# Altium project DustCollectorSwitch.PrjPcb
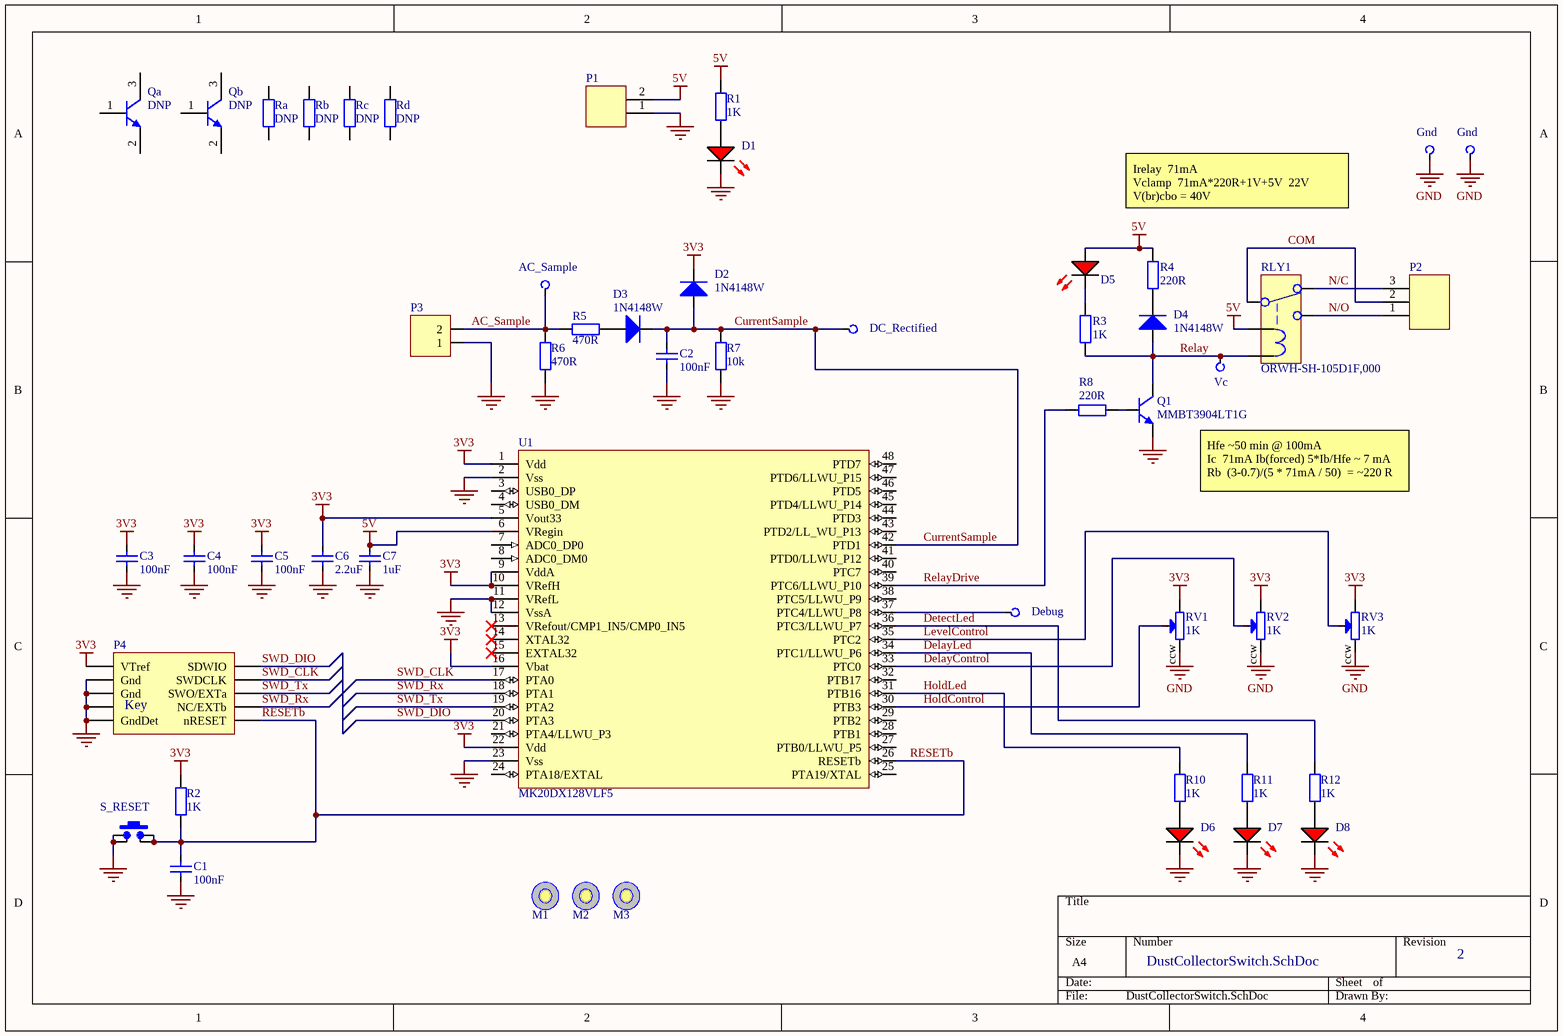
[diagram p0: DustCollectorSwitch.SchDoc]
Version: 2
1 sheet, 52 parts. Net scope: global (net labels, ports and power ports of the same name join across sheets).
Board file: DustCollectorSwitch.PcbDoc

## Sheet DustCollectorSwitch.SchDoc
size A4

### Parts
AC_Sample  (no value)  [PCBPIN - 0.9mm]  (no BOM)
C1  100nF  [CCNP1608-0603_N]
C2  100nF  [CCNP1608-0603_N]
C3  100nF  [CCNP1608-0603_N]
C4  100nF  [CCNP1608-0603_N]
C5  100nF  [CCNP1608-0603_N]
C6  2.2uF  [CCNP1608-0603_N]
C7  1uF  [CCNP1608-0603_N]
D1  LED Red  [LED1608-0603-RED]  (value not drawn)
D2  1N4148W  [SOD-123]
D3  1N4148W  [SOD-123]
D4  1N4148W  [SOD-123]
D5  LED Red  [LED1608-0603-RED]  (value not drawn)
D6  LED Red  [LED1608-0603-RED]  (value not drawn)
D7  LED Red  [LED1608-0603-RED]  (value not drawn)
D8  LED Red  [LED1608-0603-RED]  (value not drawn)
DC_Rectified  (no value)  [PCBPIN - 0.9mm]  (no BOM)
Debug  Vdd  [PCBPIN - 0.9mm]  (value not drawn)  (no BOM)
Gnd1  Gnd  [PCBPIN - 0.9mm]  (no BOM)
Gnd?  Gnd  [PCBPIN - 0.9mm]  (no BOM)
M1  Mounting hole  [3mm hole]  (value not drawn)  (no BOM)
M2  Mounting hole  [3mm hole]  (value not drawn)  (no BOM)
M3  Mounting hole  [3mm hole]  (value not drawn)  (no BOM)
P1  Terminal2_5.08mm  [MOLEX-39544-3002]  (value not drawn)
P2  Terminal3_5.08mm  [MOLEX-39544-3003]  (value not drawn)
P3  Header, 2-Pin, Right Angle  [HDR1X2H]  (value not drawn)
P4  SWD Connector 2x5-Pin  [SWD-2x5-Jig-Pads]  (value not drawn)  (no BOM)
Q1  MMBT3904LT1G  [SOT23_N]
Qa  DNP  [SOT23_M]  (no BOM)
Qb  DNP  [SOT23_M]  (no BOM)
R1  1K  [CR1608-0603_N]
R2  1K  [CR1608-0603_N]
R3  1K  [CR1608-0603_N]
R4  220R  [CR1608-0603_N]
R5  470R  [CR1608-0603_N]
R6  470R  [CR1608-0603_N]
R7  10k  [CR1608-0603_N]
R8  220R  [CR1608-0603_N]
R10  1K  [CR1608-0603_N]
R11  1K  [CR1608-0603_N]
R12  1K  [CR1608-0603_N]
Ra  DNP  [CR1608-0603_N]  (no BOM)
Rb  DNP  [CR1608-0603_N]  (no BOM)
Rc  DNP  [CR1608-0603_N]  (no BOM)
Rd  DNP  [CR1608-0603_N]  (no BOM)
RLY1  ORWH-SH-105D1F,000  [Relay - ORWH-SH]
RV1  1K  [RV_PCB5]
RV2  1K  [RV_PCB5]
RV3  1K  [RV_PCB5]
S_RESET  SMD-SW-4_5.1x5.1x3.5_M  [SMD-SW-4_5.1x5.1x3.5_M]  (value not drawn)
U1  MK20DX128VLF5  [TSQFP50P900X900-48M]
Vc  (no value)  [PCBPIN - 0.9mm]  (no BOM)

### Nets
3V3: C3.1 C4.2 C5.2 C6.2 D2.K P4.1(VTref) R2.1 RV1.cw RV2.cw RV3.cw U1.1(Vdd) U1.5(Vout33) U1.9(VddA) U1.10(VRefH) U1.16(Vbat) U1.22(Vdd)
5V: C7.2 D5.A P1.2 R1.1 R4.1 RLY1.C1 U1.6(VRegin)
GND: C1.2 C2.1 C3.2 C4.1 C5.1 C6.1 C7.1 D1.K D6.K D7.K D8.K Gnd1.1(TP) Gnd?.1(TP) P1.1 P3.1 P4.0(Pins) P4.3(Gnd) P4.5(Gnd) P4.9(GndDet) Q1.2(E) R6.1 R7.1 RV1.ccw RV2.ccw RV3.ccw S_RESET.1 S_RESET.1b U1.2(Vss) U1.11(VRefL) U1.12(VssA) U1.23(Vss)
AC_Sample: AC_Sample.1(TP) P3.2 R5.2 R6.2
COM: P2.2 RLY1.COM
CurrentSample: C2.2 D2.A D3.K DC_Rectified.1(TP) R7.2 U1.42(PTD1)
DelayControl: RV2.w U1.33(PTC0)
DelayLed: R11.1 U1.34(PTC1/LLWU_P6)
DetectLed: R12.1 U1.36(PTC3/LLWU_P7)
HoldControl: RV1.w U1.30(PTB3)
HoldLed: R10.1 U1.31(PTB16)
LevelControl: RV3.w U1.35(PTC2)
N/C: P2.3 RLY1.NC
N/O: P2.1 RLY1.NO
Relay: D4.A Q1.3(C) R3.2 RLY1.C2 Vc.1(TP)
RelayDrive: R8.1 U1.39(PTC6/LLWU_P10)
RESETb: C1.1 P4.10(nRESET) R2.2 S_RESET.2 S_RESET.2b U1.26(RESETb)
SWD_CLK: P4.4(SWDCLK) U1.17(PTA0)
SWD_DIO: P4.2(SDWIO) U1.20(PTA3)
SWD_Rx: P4.8(NC/EXTb) U1.18(PTA1)
SWD_Tx: P4.6(SWO/EXTa) U1.19(PTA2)
NetD1_A: D1.A R1.2
NetD3_A: D3.A R5.1
NetD4_K: D4.K R4.2
NetD5_K: D5.K R3.1
NetD6_A: D6.A R10.2
NetD7_A: D7.A R11.2
NetD8_A: D8.A R12.2
NetDebug_1: Debug.1(TP) U1.37(PTC4/LLWU_P8)
NetQ1_1: Q1.1(B) R8.2

Not connected (* = marked no-connect by the designer): Qa 1(B) 2(E) 3(C); Qb 1(B) 2(E) 3(C); Ra 1 2; Rb 1 2; Rc 1 2; Rd 1 2; U1 3(USB0_DP) 4(USB0_DM) 7(ADC0_DP0) 8(ADC0_DM0) 13(VRefout/CMP1_IN5/CMP0_IN5)* 14(XTAL32)* 15(EXTAL32)* 21(PTA4/LLWU_P3) 24(PTA18/EXTAL) 25(PTA19/XTAL) 27(PTB0/LLWU_P5) 28(PTB1) 29(PTB2) 32(PTB17) 38(PTC5/LLWU_P9) 40(PTC7) 41(PTD0/LLWU_P12) 43(PTD2/LL_WU_P13) 44(PTD3) 45(PTD4/LLWU_P14) 46(PTD5) 47(PTD6/LLWU_P15) 48(PTD7)

### Notes on the sheet
- Irelay  71mA
  Vclamp  71mA*220R+1V+5V  22V
  V(br)cbo = 40V
- Hfe ~50 min @ 100mA
  Ic  71mA Ib(forced) 5*Ib/Hfe ~ 7 mA
  Rb  (3-0.7)/(5 * 71mA / 50)  = ~220 R
- (in symbol SWD2X5_JIG) Key

### Library data of the parts
AC_Sample DC_Rectified Debug Gnd1 Gnd? Vc = TP: Test Point; Digikey: *; Farnell PN: *; LCSC: *
C1-C5 = Cap_CCNP_0603_100nF: Capacitor non-polar SMT 0603; Manufacturer: Generic Components; Class: Passive; Published: 08/06/2000; Publisher: Altium Hobart Technology Centre; SubClass: Capacitor; Farnell PN: *; Digikey: *; Value: 100nF; LCSC: C14663
C6 C7 = Cap: Capacitor; Manufacturer: Generic Components; Class: Passive; Published: 08/06/2000; Publisher: Altium Hobart Technology Centre; SubClass: Capacitor; Farnell PN: *; Digikey: *
  C6: Value: 2.2uF; LCSC: C23630
  C7: Value: 1uF; LCSC: C15849
D1 D5-D8 = LED-0603-Red: LED 0603 Red; Manufacturer: Generic Components; Class I: Optoelectronic; Published: 8-Jun-2000; Revision: July-2002: Re-released for DXP Platform.; Publisher: Altium Limited; Class II: LED; Farnell PN: 1581239; Digikey: *; LCSC: C2286
D2-D4 = 1N4148W: Diode - Switching 75V 150mA 1.25V @ 150mA 4ns, SOD-123; Class: Discrete; SubClass: Diode - Switching; Digikey: *; Farnell PN: *; LCSC: C81598
M1-M3 = Mounting_Hole: LCSC: *
P1 = Terminal2_5.08mm: MULTICOMP MC24366 TERMINAL BLOCK EUROSTYLE, 2 POSITION, 26-12AWG, 5.08mm; Farnell PN: 2396251; LCSC: *
P2 = Terminal3_5.08mm: MULTICOMP MC24367 TERMINAL BLOCK EUROSTYLE, 3 POSITION, 26-12AWG, 5.08mm; Farnell PN: *; LCSC: *
P3 = Header 1x2H: LatestRevisionDate: 17-Jul-2002; LatestRevisionNote: Re-released for DXP Platform.; Publisher: Altium Limited; LCSC: *
P4 = SWD2X5_JIG: LatestRevisionDate: 17-Jul-2002; LatestRevisionNote: Re-released for DXP Platform.; Publisher: Altium Limited; Farnell PN: 1865285; LCSC: *
Q1 = MMBT3904LT1G: General Purpose Transistor, NPN Silicon, 3-Pin SOT-23, Pb-Free, Tape and Reel; Manufacturer: On Semiconductor; IC Continuous (A): 0.2; fT Min (MHz): 300; ComponentLink2Description: Datasheet; Polarity: NPN; PackageDescription: 3-Pin Small Outline Transistor, Body 2.92 x 1.3 mm, Pitch 0.95 mm; ComponentLink2URL: http://www.onsemi.cn/pub_link/Collateral/MMBT3904LT1-D.PDF; DatasheetVersion: Rev. 12; Mounting Technology: Surface Mount; PartNumber: MMBT3904LT1G; ComponentLink1URL: http://www.onsemi.com/; ComponentLink3Description: Package Specification; ComponentLink1Description: Manufacturer URL; PackageVersion: Rev. AP, 11/2009; PackageReference: SOT-23-3-318-08; Packing: Tape and Reel; ComponentLink3URL: http://www.onsemi.cn/pub_link/Collateral/318-08.PDF; RoHS: TRUE; LCSC: C20526
Qa Qb = MMBT3904LT1G: SOT23; ComponentLink2Description: Datasheet; ComponentLink2URL: http://www.onsemi.cn/pub_link/Collateral/MMBT3904LT1-D.PDF; ComponentLink1URL: http://www.onsemi.com/; ComponentLink3Description: Package Specification; ComponentLink1Description: Manufacturer URL; ComponentLink3URL: http://www.onsemi.cn/pub_link/Collateral/318-08.PDF
R1-R3 R10-R12 Ra Rb Rc Rd = Res_CR0603: Resistor SMT 0603; Manufacturer: Generic Components; Class: Passive; Published: 08/06/2000; Publisher: Altium Hobart Technology Centre; SubClass: Resistor; Farnell PN: *; Digikey: *
  R1-R3 R10-R12: Value: 1K; LCSC: C21190
  Ra Rb Rc Rd: Value: DNP
R4 R8 = Res_CR0603_220R: Resistor SMT 0603; Manufacturer: Generic Components; Class: Passive; Published: 08/06/2000; Publisher: Altium Hobart Technology Centre; SubClass: Resistor; Farnell PN: *; Digikey: *; LCSC: C22962; Value: 220R
R5 R6 = Res_CR0603_470R: Resistor SMT 0603; Manufacturer: Generic Components; Class: Passive; Published: 08/06/2000; Publisher: Altium Hobart Technology Centre; SubClass: Resistor; Farnell PN: *; Digikey: *; LCSC: C23179; Value: 470R
R7 = Res_CR0603_10k: Resistor SMT 0603; Manufacturer: Generic Components; Class: Passive; Published: 08/06/2000; Publisher: Altium Hobart Technology Centre; SubClass: Resistor; Farnell PN: *; Digikey: *; LCSC: C25804; Value: 10k
RLY1 = Relay - ORWH-SH-105D1F: Relay, ORWH Series, Power, Non Latching, SPDT, 5 VDC, 10 A; LCSC: *; Farnell PN: 1181034
RV1-RV3 = POT_BOURNS_3362P: Trim Pot - single turn horizontal; Value: 1K; Digikey: *; Farnell PN: 9354298 or similar; LCSC: *
S_RESET = SW_PB-TS: Tactile Switch SPST 5.10mm X 5.10mm / (1.5mm=C318884) / (2.0mm=C318888) / (3.5mm=C318886); Revision: 1.0; LCSC: C318886
U1 = MK20DX128VLF5: Micro Kinetis K20: 50MHz Cortex-M4 Performance MCU, 160KB Flash, 16KB SRAM, Full-Speed USB, 48-LQFP; Farnell PN: 2133571; Digikey: MK20DX128VLF50-ND; Mouser: 841-MK20DX128VLF5; LCSC: *